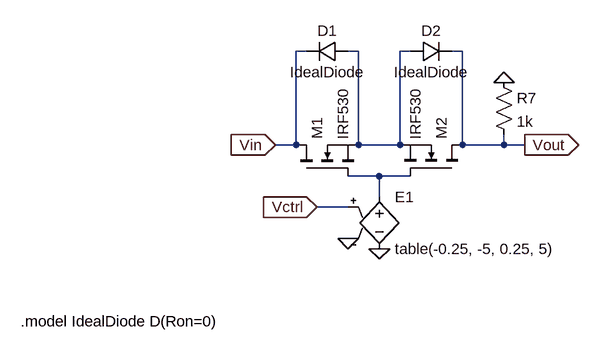
[diagram p0: schematic bidirectional_switch_amplified.asc]
bidirectional_switch_amplified.asc, the LTspice schematic file:
Version 4
SHEET 1 880 680
WIRE 96 0 80 0
WIRE 176 0 160 0
WIRE 256 0 240 0
WIRE 336 0 320 0
WIRE 80 144 80 0
WIRE 80 144 48 144
WIRE 176 144 176 0
WIRE 240 144 240 0
WIRE 240 144 176 144
WIRE 336 144 336 0
WIRE 400 144 400 128
WIRE 400 144 336 144
WIRE 432 144 400 144
WIRE 208 192 160 192
WIRE 256 192 208 192
WIRE 208 224 208 192
WIRE 160 240 112 240
FLAG 48 144 Vin
IOPIN 48 144 In
FLAG 432 144 Vout
IOPIN 432 144 Out
FLAG 112 240 Vctrl
IOPIN 112 240 In
FLAG 400 48 0
FLAG 208 304 0
FLAG 160 288 0
SYMBOL nmos 80 192 R270
SYMATTR InstName M1
SYMATTR Value IRF530
SYMBOL nmos 336 192 M270
SYMATTR InstName M2
SYMATTR Value IRF530
SYMBOL diode 160 -16 R90
WINDOW 0 0 32 VBottom 2
WINDOW 3 32 32 VTop 2
SYMATTR InstName D1
SYMATTR Value IdealDiode
SYMBOL diode 256 16 R270
WINDOW 0 32 32 VTop 2
WINDOW 3 0 32 VBottom 2
SYMATTR InstName D2
SYMATTR Value IdealDiode
SYMBOL res 384 32 R0
SYMATTR InstName R7
SYMATTR Value 1k
SYMBOL e 208 208 R0
SYMATTR InstName E1
SYMATTR Value table(-0.25, -5, 0.25, 5)
TEXT -344 416 Left 2 !.model IdealDiode D(Ron=0)

The netlist it stands for:
* bidirectional_switch_amplified.asc
M1 Vin N002 N001 N001 IRF530
M2 Vout N002 N001 N001 IRF530
D1 N001 Vin IdealDiode
D2 N001 Vout IdealDiode
R7 0 Vout 1k
E1 N002 0 Vctrl 0 table(-0.25, -5, 0.25, 5)
.model D D
.lib standard.dio
.model NMOS NMOS
.model PMOS PMOS
.lib standard.mos
.model IdealDiode D(Ron=0)
.backanno
.end